# Altium schematic sheet TutorialLED.SchDoc
size A; SheetNumber: 2; SheetTotal: 2
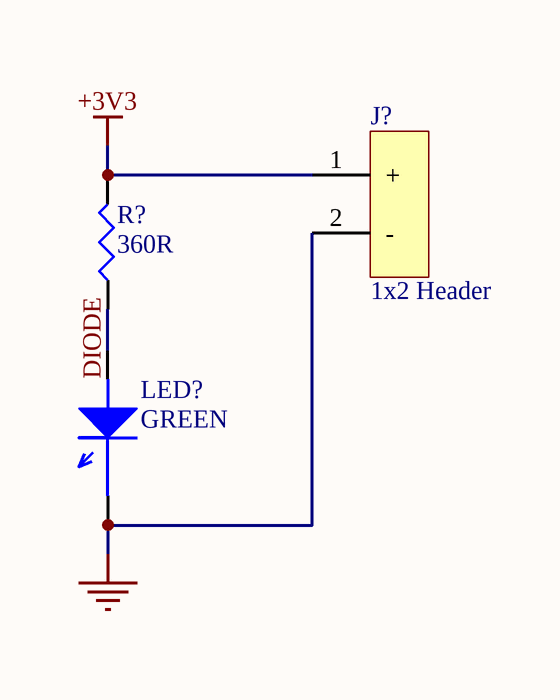
[diagram p0: TutorialLED.SchDoc]

## Parts
J?  1x2 Header
LED?  GREEN
R?  360R

## Nets
+3V3: J?.1(+) R?.2
GND: J?.2(-) LED?.1
NetLED?_2: LED?.2 R?.1

## Notes on the sheet
- Labels drawn without touching a wire or pin: DIODE

## Library data of the parts
J? = 0022292021: Board Connector, 2 Contact(s), 1 Row(s), Male, Straight, Solder Terminal; Manufacturer: Molex; Supplier: Newark; Supplier Part Number: 26AC6573; Manufacturer Part Number: 0022292021; RoHS: No; Stock: 37058; Pricing: 1=0.53, 10=0.45, 25=0.408, 50=0.375, 100=0.343, 250=0.335 (USD); Category: Connectors, Interconnects
LED? = 156120VS82500: Single Color LED; Manufacturer: Wurth Electronics; Supplier: Newark; Supplier Part Number: 22AC3294; Manufacturer Part Number: 156120VS82500; RoHS: Yes; Category: LEDs; Stock: 97; Pricing: 5=0.449, 10=0.445, 25=0.405, 50=0.365, 100=0.261 (USD); Optoelectronic Device Type: SINGLE COLOR LED; Reach SVHC Compliant: Yes; RoHS Compliant: Yes; ComponentLink1URL: https://datasheet.ciiva.com:443/pdfs/VipMasterIC/IC/MIDC/MIDC-S-A0007332242/MIDC-S-A0007332242-1.pdf?src-supplier=IHS+Markit; ComponentLink1Description: https://datasheet.ciiva.com:443/pdfs/VipMasterIC/IC/MIDC/MIDC-S-A0007332242/MIDC-S-A0007332242-1.pdf?src-supplier=IHS+Markit; ComponentLink2URL: http://www.farnell.com/datasheets/2301743.pdf?src-supplier=Farnell; ComponentLink2Description: http://www.farnell.com/datasheets/2301743.pdf?src-supplier=Farnell; ComponentLink3URL: https://katalog.we-online.de/led/datasheet/156120VS82500.pdf?src-supplier=Digi-Key; ComponentLink3Description: https://katalog.we-online.de/led/datasheet/156120VS82500.pdf?src-supplier=Digi-Key; ComponentLink4URL: http://www.farnell.com/datasheets/2301743.pdf?src-supplier=Newark; ComponentLink4Description: http://www.farnell.com/datasheets/2301743.pdf?src-supplier=Newark
R? = CRCW0805360RFKEA: Fixed Resistor, Metal Glaze/thick Film, 0.125W, 360ohm, 150V, 1% +/-Tol, 100ppm/Cel, Surface Mount, 0805; Manufacturer: Vishay; Power: 125mW; Rated Temperature: 70°C; Temperature Coefficient: 100ppm/°C; Package Height: 0.45mm; Package Length: 2mm; Package Width: 1.25mm; Reference Standard: AEC-Q200; Supplier: Arrow Electronics; Supplier Part Number: CRCW0805360RFKEA; Manufacturer Part Number: CRCW0805360RFKEA; RoHS: Yes; Category: Chip SMD Resistors; Stock: 2; Pricing: 1=0.0772 (USD); Mounting Technology: Surface Mount; Pins: 2; Package Shape: Rectangular; Case/Package: 0805; Terminal Finish: Nickel; Min Operating Temperature: -55°C; Max Operating Temperature: 155°C; Tolerance: 1%; JESD-609 Code: e3; Resistor Type: FIXED RESISTOR; Construction: Chip; Package Style: SMTMeter; Packaging: Tape and Reel; Value: 360R; Technology: METAL GLAZE/THICK FILM; Termination: Wraparound; Working Voltage: 150V; RoHS Compliant: Yes; Reach SVHC Compliant: Yes; ComponentLink1URL: https://datasheet.ciiva.com:443/pdfs/VipMasterIC/IC/VISH/VISH-S-A0007266705/VISH-S-A0007266705-1.pdf?src-supplier=IHS+Markit; ComponentLink1Description: https://datasheet.ciiva.com:443/pdfs/VipMasterIC/IC/VISH/VISH-S-A0007266705/VISH-S-A0007266705-1.pdf?src-supplier=IHS+Markit; ComponentLink2URL: https://datasheet.ciiva.com/2467/dcrcwe3-2467773.pdf?src-supplier=Digi-Key; ComponentLink2Description: https://datasheet.ciiva.com/2467/dcrcwe3-2467773.pdf?src-supplier=Digi-Key